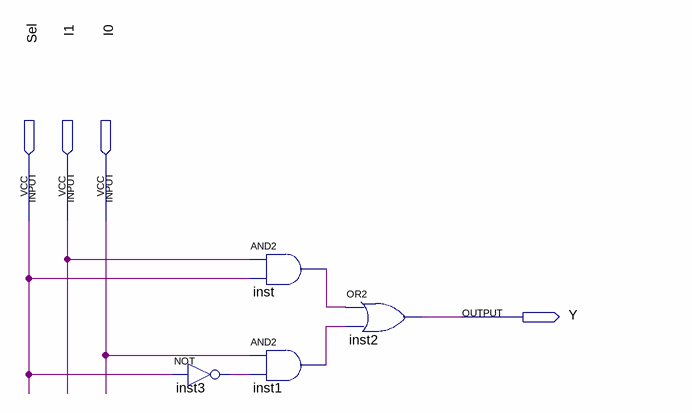
[diagram p0: schematic sheet]
// Quartus schematic MUX2_1bits.bdf as structural Verilog: 4 symbols, 4 pins
module MUX2_1bits (
  input  Sel,
  input  I1,
  input  I0,
  output Y
);

  wire inst1_out, inst3_out, inst_out;

  not inst3 (inst3_out, Sel);
  and inst (inst_out, I1, Sel);
  and inst1 (inst1_out, I0, inst3_out);
  or inst2 (Y, inst_out, inst1_out);
endmodule
